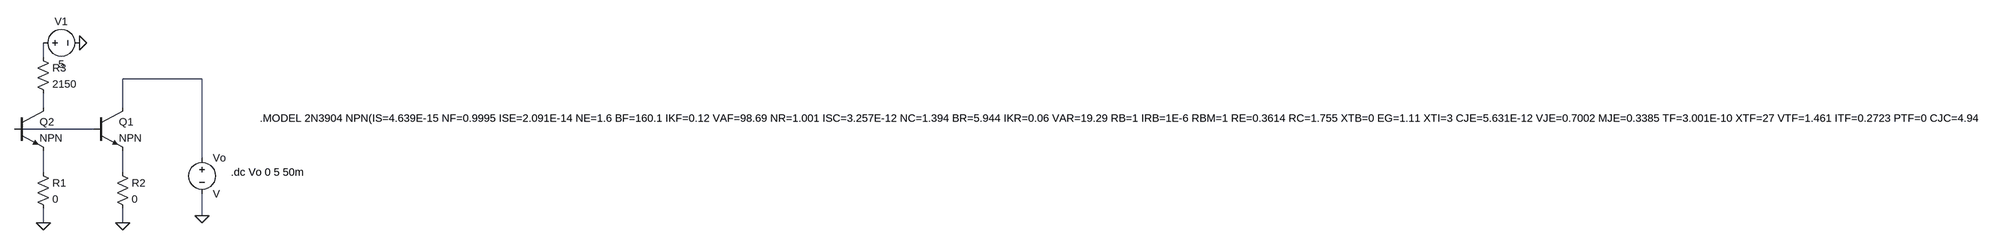
[diagram p0: schematic ELE344_Lab4.asc]
ELE344_Lab4.asc, the LTspice schematic file:
Version 4
SHEET 1 5816 680
WIRE 128 16 128 -16
WIRE 480 64 304 64
WIRE 128 128 128 96
WIRE 304 128 304 64
WIRE 240 176 64 176
WIRE 480 240 480 64
WIRE 128 272 128 224
WIRE 304 272 304 224
WIRE 480 368 480 320
WIRE 128 384 128 352
WIRE 304 384 304 352
FLAG 208 -16 0
FLAG 304 384 0
FLAG 128 384 0
FLAG 480 368 0
SYMBOL npn 240 128 R0
SYMATTR InstName Q1
SYMBOL npn 64 128 R0
SYMATTR InstName Q2
SYMBOL res 112 256 R0
SYMATTR InstName R1
SYMATTR Value 0
SYMBOL res 288 256 R0
SYMATTR InstName R2
SYMATTR Value 0
SYMBOL res 112 0 R0
SYMATTR InstName R3
SYMATTR Value 2150
SYMBOL voltage 112 -16 R270
WINDOW 0 32 56 VTop 2
WINDOW 3 -32 56 VBottom 2
WINDOW 123 0 0 Left 0
WINDOW 39 0 0 Left 0
SYMATTR InstName V1
SYMATTR Value 5
SYMBOL voltage 480 224 R0
SYMATTR InstName Vo
TEXT 544 272 Left 2 !.dc Vo 0 5 50m
TEXT 608 152 Left 2 !.MODEL 2N3904 NPN(IS=4.639E-15 NF=0.9995 ISE=2.091E-14 NE=1.6 BF=160.1 IKF=0.12 VAF=98.69 NR=1.001 ISC=3.257E-12 NC=1.394 BR=5.944 IKR=0.06 VAR=19.29 RB=1 IRB=1E-6 RBM=1 RE=0.3614 RC=1.755 XTB=0 EG=1.11 XTI=3 CJE=5.631E-12 VJE=0.7002 MJE=0.3385 TF=3.001E-10 XTF=27 VTF=1.461 ITF=0.2723 PTF=0 CJC=4.949E-12 VJC=0.5969 MJC=0.1928 XCJC=0.864 TR=9.4E-8 CJS=0 VJS=0.75 MJS=0.333 FC=0.5582)

The netlist it stands for:
* ELE344_Lab4.asc
Q1 N002 N004 N006 0 NPN
Q2 N003 N004 N005 0 NPN
R1 N005 0 0
R2 N006 0 0
R3 N001 N003 2150
V1 N001 0 5
Vo N002 0 V
.model NPN NPN
.model PNP PNP
.lib standard.bjt
.dc Vo 0 5 50m
.MODEL 2N3904 NPN(IS=4.639E-15 NF=0.9995 ISE=2.091E-14 NE=1.6 BF=160.1 IKF=0.12 VAF=98.69 NR=1.001 ISC=3.257E-12 NC=1.394 BR=5.944 IKR=0.06 VAR=19.29 RB=1 IRB=1E-6 RBM=1 RE=0.3614 RC=1.755 XTB=0 EG=1.11 XTI=3 CJE=5.631E-12 VJE=0.7002 MJE=0.3385 TF=3.001E-10 XTF=27 VTF=1.461 ITF=0.2723 PTF=0 CJC=4.949E-12 VJC=0.5969 MJC=0.1928 XCJC=0.864 TR=9.4E-8 CJS=0 VJS=0.75 MJS=0.333 FC=0.5582)
.backanno
.end